# Altium schematic sheet Power_USB.SchDoc
size A; SheetNumber: 2; SheetTotal: 3
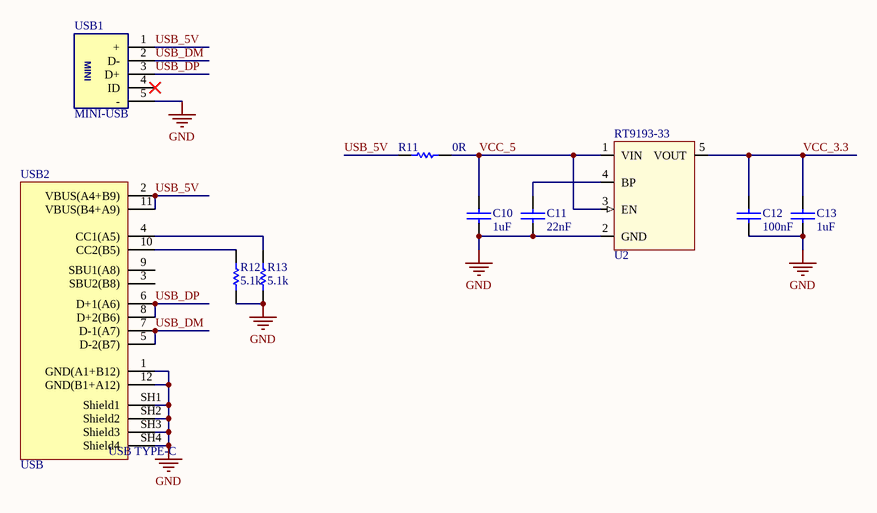
[diagram p0: Power_USB.SchDoc]

## Parts
C10  1uF  [C 0603_L]
C11  22nF  [C 0603_L]
C12  100nF  [C 0603_L]
C13  1uF  [C 0603_L]
R11  0R  [0603R]
R12  5.1k  [0603R]
R13  5.1k  [0603R]
U2  RT9193-33  [SOT23-5L]
USB1  MINI-USB  [USB-MINI-A]
USB2  USB  [USB Type-C]

## Nets
GND: C10.1 C11.1 C12.1 C13.1 R12.2 R13.2 U2.2(GND) USB1.5(-) USB2.1(GND(A1+B12)) USB2.12(GND(B1+A12)) USB2.SH1(Shield1) USB2.SH2(Shield2) USB2.SH3(Shield3) USB2.SH4(Shield4)
USB_5V: R11.1 USB1.1(+) USB2.2(VBUS(A4+B9)) USB2.11(VBUS(B4+A9))
USB_DM: USB1.2(D-) USB2.5(D-2(B7)) USB2.7(D-1(A7))
USB_DP: USB1.3(D+) USB2.6(D+1(A6)) USB2.8(D+2(B6))
VCC_3.3: C12.2 C13.2 U2.5(VOUT)
VCC_5: C10.2 R11.2 U2.1(VIN) U2.3(EN)
NetC11_2: C11.2 U2.4(BP)
NetR12_1: R12.1 USB2.10(CC2(B5))
NetR13_1: R13.1 USB2.4(CC1(A5))

Not connected (* = marked no-connect by the designer): USB1 4(ID)*; USB2 3(SBU2(B8)) 9(SBU1(A8))

## Notes on the sheet
- (in symbol MINI-USB) MINI
- (in symbol USB Type-C) USB TYPE-C

## Library data of the parts
C10-C13 = CAP: 无极性电容
R11-R13 = RES
U2 = RT9193X_5P: ICA_MFR_NAME: RICHTEK; ICA_PARTNUM: $$2191094$$RT9193-15CU5; Part Number: TMP-13
USB2 = USB Type-C: 12P TypeC 母座